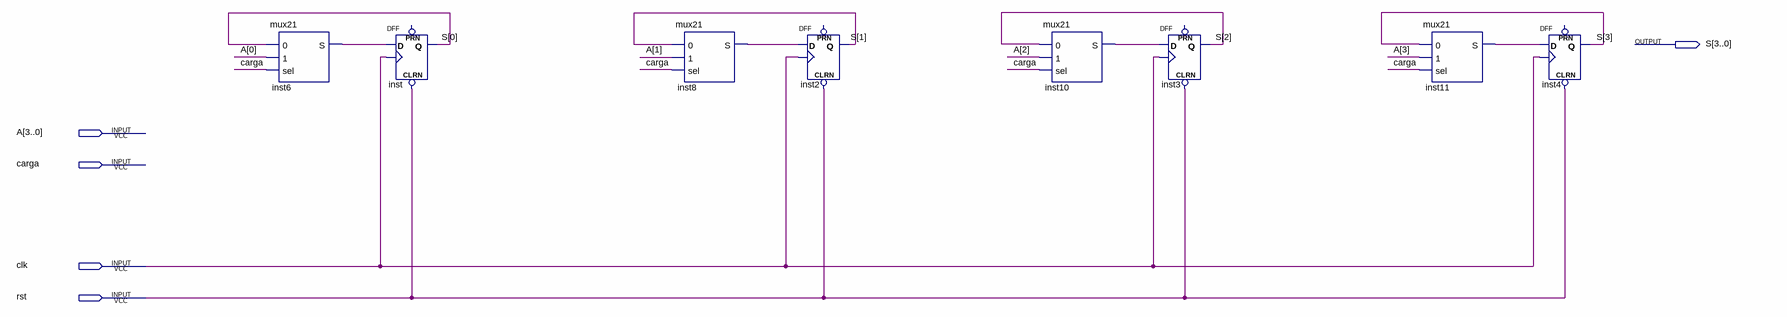
[diagram p0: schematic sheet]
// Quartus schematic opcode.bdf as structural Verilog: 8 symbols, 5 pins
module opcode (
  input  [3:0] A,
  input  carga,
  input  clk,
  input  rst,
  output [3:0] S
);

  wire inst6_s, inst8_s, inst10_s, inst11_s;

  mux21 inst6 (.\0 (S[0]), .\1 (A[0]), .sel(carga), .S(inst6_s));
  DFF inst (.CLRN(rst), .CLK(clk), .D(inst6_s), .Q(S[0]));  // open: PRN
  mux21 inst8 (.\0 (S[1]), .\1 (A[1]), .sel(carga), .S(inst8_s));
  DFF inst2 (.CLRN(rst), .CLK(clk), .D(inst8_s), .Q(S[1]));  // open: PRN
  mux21 inst10 (.\0 (S[2]), .\1 (A[2]), .sel(carga), .S(inst10_s));
  DFF inst3 (.CLRN(rst), .CLK(clk), .D(inst10_s), .Q(S[2]));  // open: PRN
  mux21 inst11 (.\0 (S[3]), .\1 (A[3]), .sel(carga), .S(inst11_s));
  DFF inst4 (.CLRN(rst), .CLK(clk), .D(inst11_s), .Q(S[3]));  // open: PRN
endmodule
